# EAGLE design rj45_jumper_box (EAGLE 7.7.0)
REVISION: v2
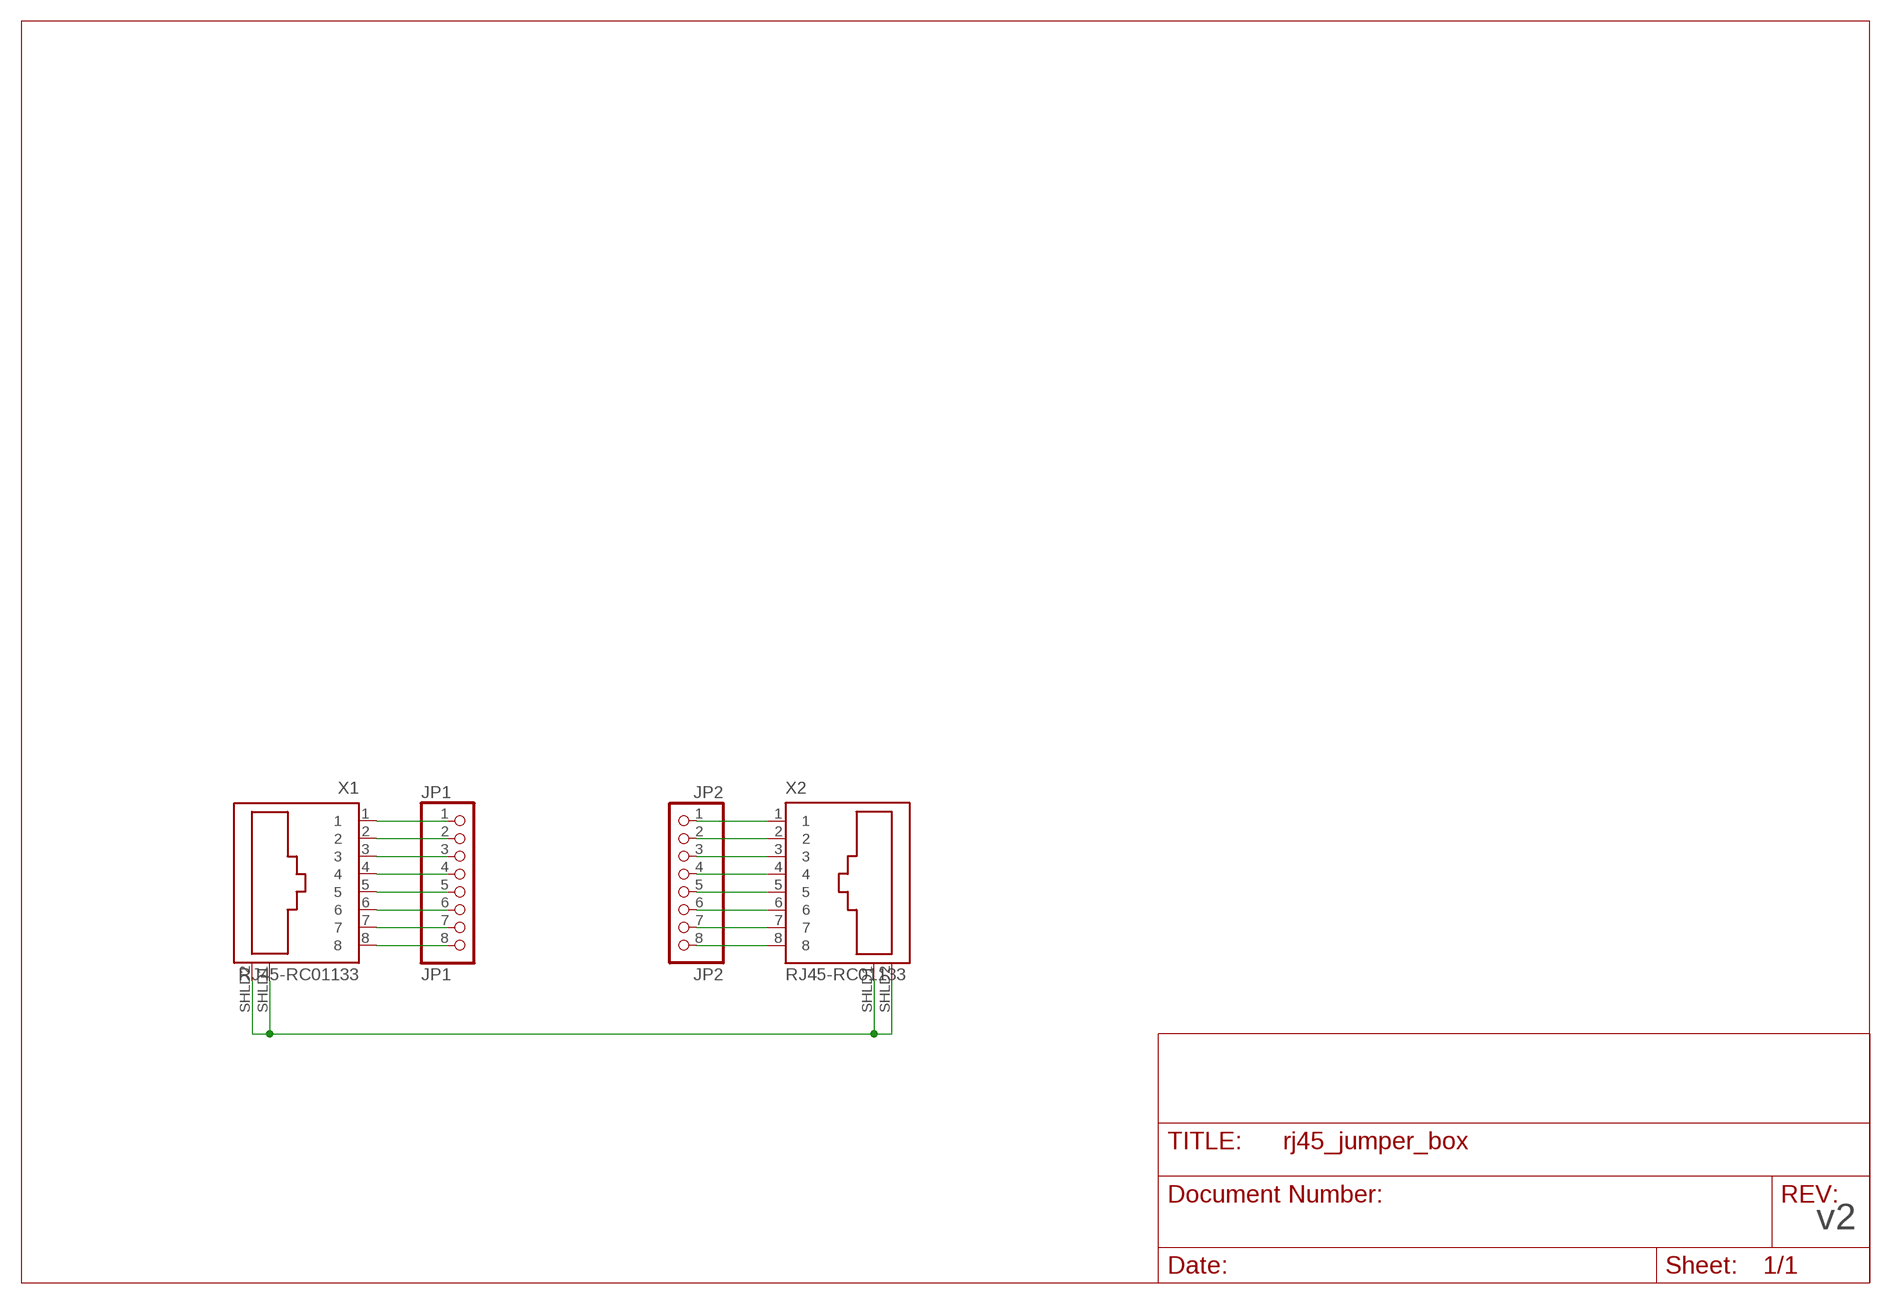
[diagram p0: schematic, sheet 1]

## Parts
JP1  JP1  PINHD-1X8  [1X08]
JP2  JP2  PINHD-1X8  [1X08]
X1  RJ45-RC01133  [RC01133]
X2  RJ45-RC01133  [RC01133]

## Nets
N$1: X1.SHLD1(S1) X1.SHLD2(S2) X2.SHLD1(S1) X2.SHLD2(S2)
N$2: JP1.2 X1.2
N$3: JP1.3 X1.3
N$4: JP1.4 X1.4
N$5: JP1.5 X1.5
N$6: JP1.6 X1.6
N$7: JP1.7 X1.7
N$8: JP1.8 X1.8
N$10: JP2.2 X2.2
N$11: JP2.3 X2.3
N$12: JP2.4 X2.4
N$13: JP2.5 X2.5
N$14: JP2.6 X2.6
N$15: JP2.7 X2.7
N$16: JP2.8 X2.8
X1_1: JP1.1 X1.1
X2_1: JP2.1 X2.1

## Library data of the parts
JP1 JP2 = pinhead:PINHD-1X8: PIN HEADER
X1 X2 = stewart-rj45:RJ45: RJ45 connector 8P8C Stewart shielded horizontal

## Board
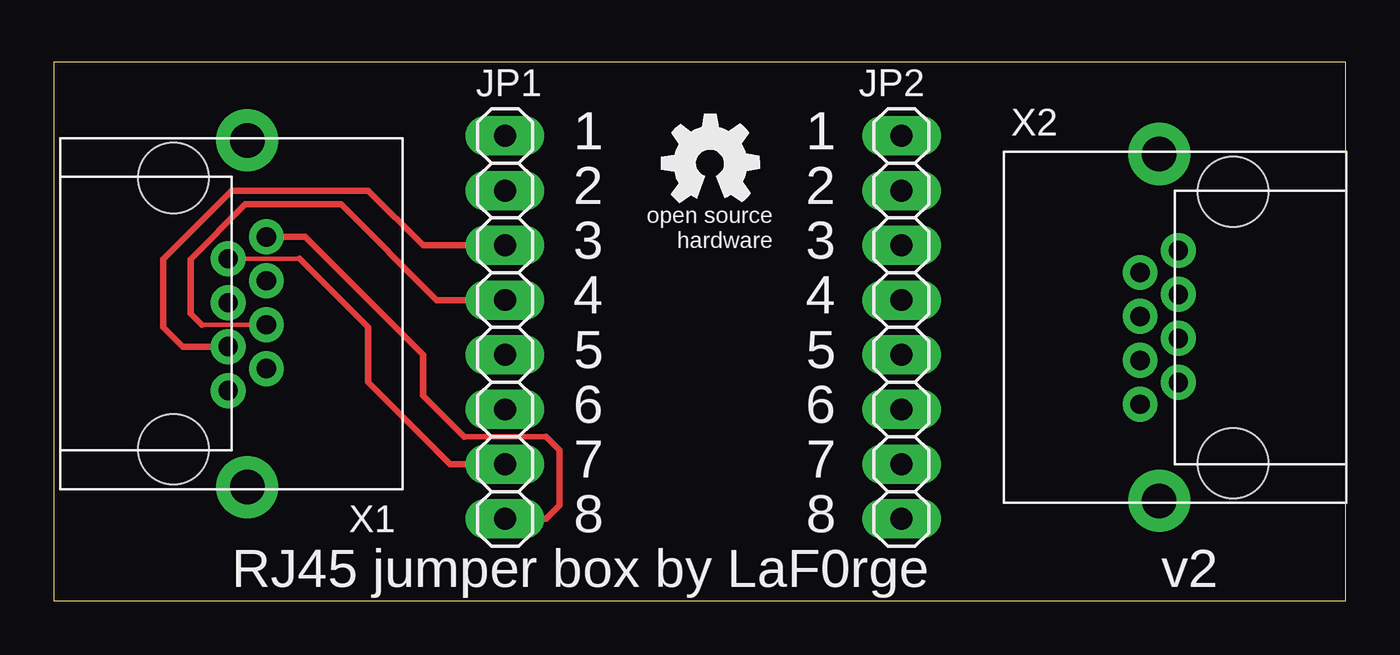
[diagram p1: board, top side]
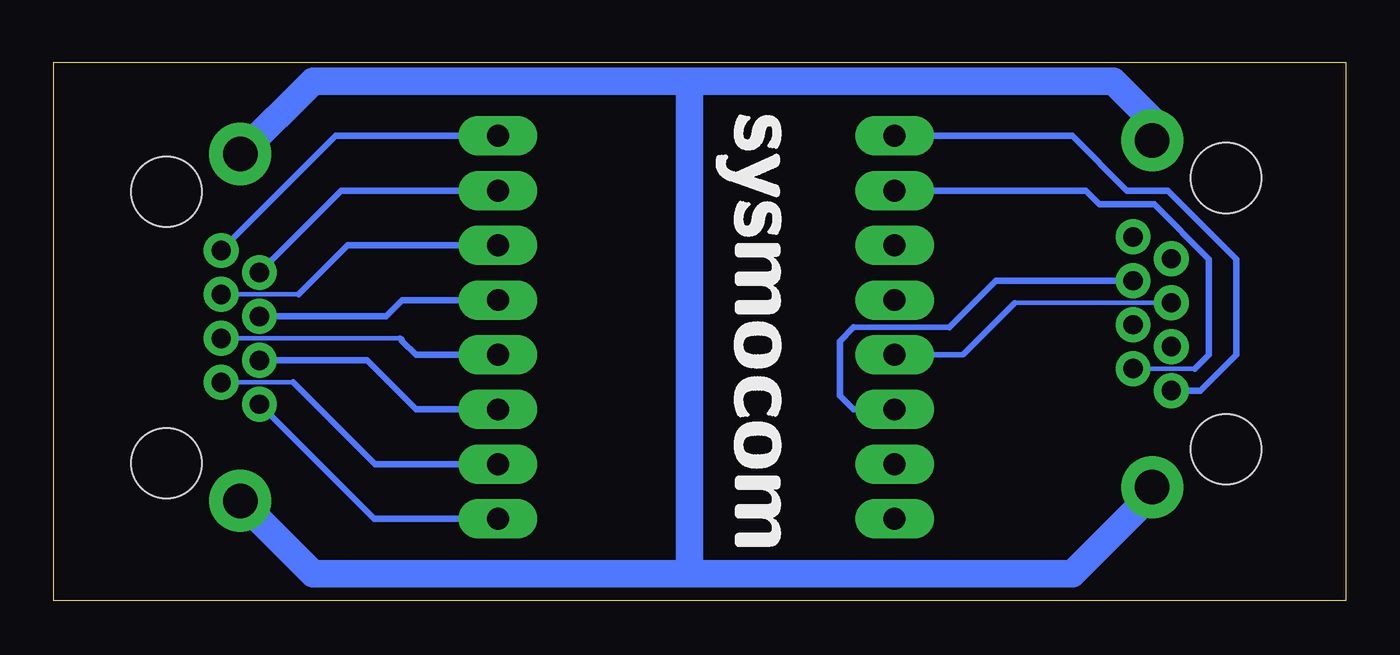
[diagram p2: board, bottom side, seen from below]

Size 60 x 25 mm. Coordinates in mm from the lower left corner, seen from the top.
Outline: 0,0 60,0 60,25 0,25 0,0
Copper layers (1*16): Top 0.035mm / dielectric 1.6mm / Bottom 0.035mm
Design rules "jlcpcb-2layers *": minimum track width 5mil, minimum drill 0.3mm, track to track 5mil, track to pad 5mil, pad to pad 5mil, via to via 5mil, smd to smd 5mil, copper to edge 0.2mm, drill to drill 6mil, minimum pad ring 10mil, minimum via ring 3mil, stop-mask expansion 0.05mm, vias tented up to drill 0mil, thermal gap 10mil

### Footprints (pad centres in the part's own frame; a part is rotated, then mirrored left to right if it is on the bottom)
1X08 = drill 1.016 long: 1 -8.89,0; 2 -6.35,0; 3 -3.81,0; 4 -1.27,0; 5 1.27,0; 6 3.81,0; 7 6.35,0; 8 8.89,0
RC01133 = drill 0.9: 1 -3.57,0.16; 2 -2.55,-1.62; 3 -1.53,0.16; 4 -0.51,-1.62; 5 0.51,0.16; 6 1.53,-1.62; 7 2.55,0.16; 8 3.57,-1.62 | drill 1.6: SHLD1 -8.05,-0.73; SHLD2 8.05,-0.73 | hole 3.25: -6.3,2.7; 6.3,2.7

### Placement (x,y rotation side)
JP1  20.95,12.7 270 top
JP2  39.37,12.7 270 top
U$1  [OSHW_5MM]  30.48,20.32 0 top
U$2  [SYSMOCOM-20-BPLACE]  29.21,2.54 90 top
X1  8.26,13.34 90 top
X2  52.07,12.7 270 top

### Tracks (layer width: path | path; a pad name or v marks a point on that pad's centre or on a via)
N$1
  Bottom 1.27: X1.SHLD2 8.98,22.32 10.79,24.13 30.48,24.13 | X1.SHLD1 8.98,4.99 12.7,1.27 30.48,1.27 | 30.48,1.27 47.96,1.27 X2.SHLD2 | X2.SHLD1 47.96,24.13 30.48,24.13 | 30.48,24.13 30.48,1.27
N$2
  Bottom 0.2: X1.2 7,10.79
  Bottom 0.305: 7,10.79 6.35,11.43 6.35,15.88 8.89,18.41 11.43,18.41 12.06,19.05 JP1.2
N$3
  Top 0.305: X1.3 5.97,11.8 5.08,12.7 5.08,15.88 8.26,19.05 14.61,19.05 17.14,16.51 JP1.3
N$4
  Top 0.2: X1.4 6.86,12.82
  Top 0.305: 6.86,12.82 6.35,13.34 6.35,15.88 8.89,18.41 13.34,18.41 17.78,13.97 JP1.4
N$5
  Bottom 0.2: X1.5 15.37,13.85
  Bottom 0.25: 15.37,13.85 17.78,11.43 JP1.5 21.59,11.43
N$6
  Bottom 0.25: 18.41,12.7 22.86,12.7
  Bottom 0.305: X1.6 16.25,14.87 18.41,12.7 | 22.86,12.7 23.5,12.06 23.5,9.53 22.86,8.89 JP1.6
N$7
  Top 0.2: X1.7 11.42,15.88
  Top 0.305: 11.42,15.88 14.61,12.7 14.61,10.16 18.41,6.35 JP1.7
N$8
  Top 0.25: 19.05,7.62 22.86,7.62
  Top 0.305: X1.8 11.67,16.91 17.14,11.43 17.14,9.53 19.05,7.62 | 22.86,7.62 23.5,6.99 23.5,4.45 22.86,3.81 JP1.8
N$10
  Bottom 0.305: JP2.2 46.65,19.05 X2.2
N$11
  Bottom 0.2: X2.3 48.63,14.23
  Bottom 0.305: 48.63,14.23 46.35,16.51 JP2.3
N$12
  Bottom 0.305: X2.4 44.58,13.21 43.81,13.97 JP2.4 38.73,13.97
N$13
  Bottom 0.2: X2.5 43.94,12.19
  Bottom 0.25: 43.94,12.19 arc90 43.81,12.06
  Bottom 0.305: 43.81,12.06 43.18,11.43 JP2.5
N$14
  Bottom 0.305: JP2.6 43.18,8.89 45.46,11.17 X2.6
N$15
  Bottom 0.2: X2.7 48.88,10.15
  Bottom 0.305: 48.88,10.15 45.09,6.35 JP2.7
N$16
  Bottom 0.305: JP2.8 45.13,3.81 X2.8
X1_1
  Bottom 0.305: X1.1 6.75,9.77 5.08,11.43 5.08,15.88 8.26,19.05 10.16,19.05 12.7,21.59 JP1.1
X2_1
  Bottom 0.305: JP2.1 46.91,21.59 X2.1

### Text on the board
tPlace: 1 | 1 | 2 | 2 | 3 | 3 | 4 | 4 | 5 | 5 | 6 | 6 | 7 | 7 | 8 | 8 | RJ45 jumper box by LaF0rge